# Altium schematic sheet SPI.SchDoc: Temperature
size A4; Date: 04/19/2026; Author: Lanfroid-Nazac Guillaume; DrawnBy: Lanfroid-Nazac Guillaume; Revision: v1.0; SheetNumber: 3; SheetTotal: 7
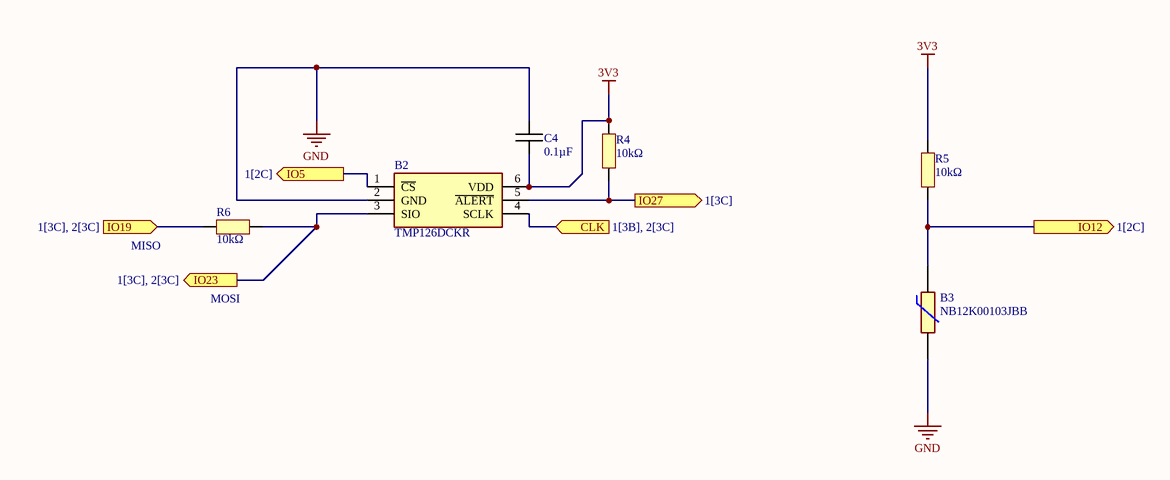
[diagram p0: SPI.SchDoc]

## Parts
B2  TMP126DCKR  [SOT65P210X110-6N]
B3  NB12K00103JBB  [RESC2212X50N]
C4  0.1µF  [CAPC1005X06N]
R4  10kΩ  [RESC1005X06N]
R5  10kΩ  [RESC1005X06N]
R6  10kΩ  [RESC1005X06N]

## Ports
CLK (in, see 1[3B], 2[3C]), IO5 (out, see 1[2C]), IO12 (out, see 1[2C]), IO19 (in, see 1[3C], 2[3C]), IO23 (out, see 1[3C], 2[3C]), IO27 (out, see 1[3C])

## Nets
3V3: B2.6(VDD) C4.1 R4.2 R5.1
GND: B2.2(GND) B3.2 C4.2
CLK: B2.4(SCLK) ; port CLK
IO5: B2.1(~{CS}) ; port IO5
IO12: B3.1 R5.2 ; port IO12
IO19: R6.2 ; port IO19
IO23: B2.3(SIO) R6.1 ; port IO23
IO27: B2.5(~{ALERT}) R4.1 ; port IO27

## Notes on the sheet
- MISO
- MOSI

## Library data of the parts
B2 = TMP126DCKR: Board Mount Temperature Sensors +/-0.25 C SPI temperature sensor with 175 C operation, CRC and slew-rate alert; Manufacturer_Name: Texas Instruments; Manufacturer_Part_Number: TMP126DCKR; Mouser Part Number: 595-TMP126DCKR
B3 = NB12K00103JBB: NTC SMD Thermistor, NB12K, 10K, 5% AVX 10k 0805 Protection NTC Thermistor, 5s, 2 x 1.25 x 1.3mm; Manufacturer_Name: Kyocera AVX; Geometry.Height: 0.5mm; Manufacturer_Part_Number: NB12K00103JBB; Mouser Part Number: 581-NB12K00103JBB; Mouser Price/Stock: https://www.mouser.co.uk/ProductDetail/AVX/NB12K00103JBB/?qs=4%252B6%252BTdINQeDPvI%252BQUQjJ3Q%3D%3D; Arrow Part Number: NB12K00103JBB; Arrow Price/Stock: https://www.arrow.com/en/products/nb12k00103jbb/avx; Datasheet Link: https://datasheet.datasheetarchive.com/originals/distributors/Datasheets-DGA6/551314.pdf
C4 = Capacitor
R4-R6 = Resistor